# Altium project StEth32.PrjPcb
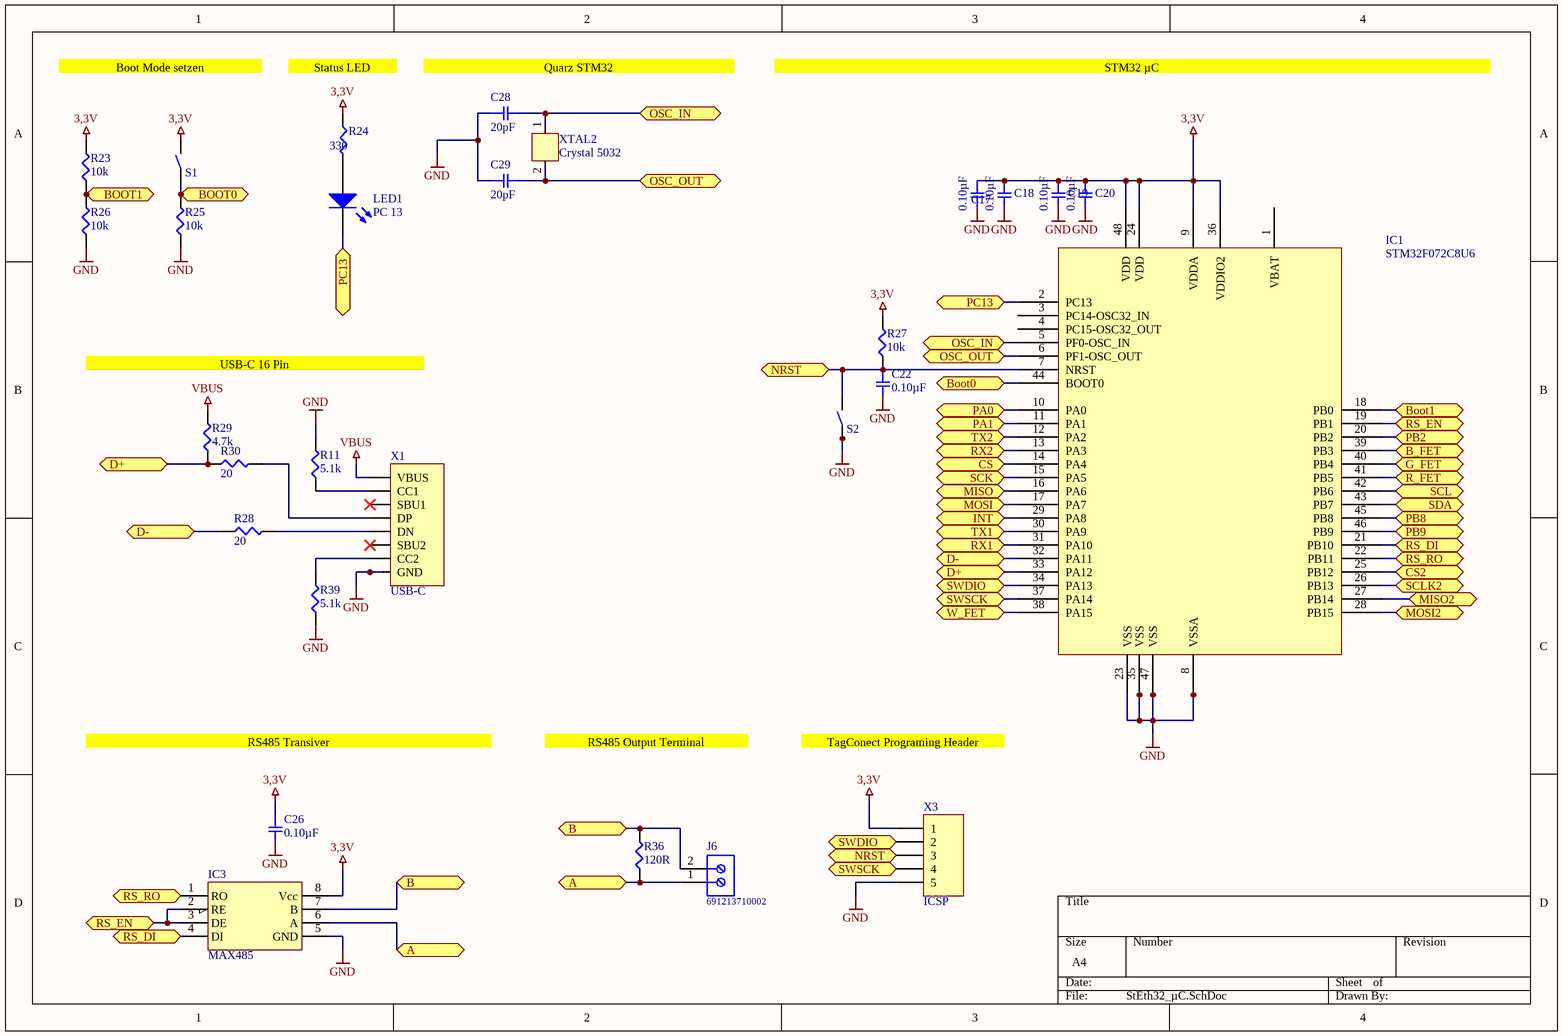
[diagram p0: StEth32_µC.SchDoc]
3 sheets, 105 parts. Net scope: flat (ports and power ports of the same name join across sheets).
Board file: StEth32.PcbDoc
Sheets:
  StEth32_µC.SchDoc
  StEth32_Power.SchDoc
  StEth32_W5500.SchDoc

## Sheet StEth32_µC.SchDoc
size A4

### Parts
C17  0.10µF  [SMD-0603C]
C18  0.10µF  [SMD-0603C]
C19  0.10µF  [SMD-0603C]
C20  0.10µF  [SMD-0603C]
C22  0.10µF  [SMD-0603C]
C26  0.10µF  [SMD-0603C]
C28  20pF  [SMD-0603C]
C29  20pF  [SMD-0603C]
IC1  STM32F072C8U6  [LQFP-48]
IC3  MAX485  [D008_L]
J6  691213710002  [691213710002]
LED1  PC 13  [0603_A]
R11  5.1k  [SMD-0603-RES]
R23  10k  [SMD-0603-RES]
R24  330  [SMD-0603-RES]
R25  10k  [SMD-0603-RES]
R26  10k  [SMD-0603-RES]
R27  10k  [SMD-0603-RES]
R28  20  [SMD-0603-RES]
R29  4.7k  [SMD-0603-RES]
R30  20  [SMD-0603-RES]
R36  120R  [SMD-0603-RES]
R39  5.1k  [SMD-0603-RES]
S1  Boot  [Button5050]  (value not drawn)
S2  Reset  [Button5050]  (value not drawn)
X1  USB-C  [USB-C]
X3  ICSP  [TC2030-MCP-NL]
XTAL2  Crystal 5032  [5032]

### Ports
A (bidir), B (bidir), B_FET (bidir), Boot0 (bidir), BOOT0 (bidir), BOOT1 (bidir), Boot1 (bidir), CS2 (bidir), CS (bidir), D+ (bidir), D- (bidir), G_FET (bidir), INT (bidir), MISO2 (bidir), MISO (bidir), MOSI2 (bidir), MOSI (bidir), NRST (bidir), OSC_IN (bidir), OSC_OUT (bidir), PA0 (bidir), PA1 (bidir), PB2 (bidir), PB8 (bidir), PB9 (bidir), PC13 (bidir), R_FET (bidir), RS_DI (bidir), RS_EN (bidir), RS_RO (bidir), RX1 (bidir), RX2 (bidir), SCK (bidir), SCL (bidir), SCLK2 (bidir), SDA (bidir), SWDIO (bidir), SWSCK (bidir), TX1 (bidir), TX2 (bidir), W_FET (bidir)

### Nets
3,3V: C17.1 C18.1 C19.1 C20.1 C26.1 IC1.9(VDDA) IC1.24(VDD) IC1.36(VDDIO2) IC1.48(VDD) IC3.8(Vcc) R23.2 R24.1 R27.2 S1.2 X3.1
GND: C17.2 C18.2 C19.2 C20.2 C22.2 C26.2 C28.1 C29.1 IC1.8(VSSA) IC1.23(VSS) IC1.35(VSS) IC1.47(VSS) IC3.5(GND) R11.2 R25.1 R26.1 R39.1 S2.1 X1.GND X3.5
VBUS: R29.2 X1.VBUS
NetC22_1: C22.1 IC1.7(NRST) R27.1 S2.2 X3.3 ; port NRST
NetC28_2: C28.2 IC1.5(PF0-OSC_IN) XTAL2.1 ; port OSC_IN
NetC29_2: C29.2 IC1.6(PF1-OSC_OUT) XTAL2.2 ; port OSC_OUT
NetIC1_2: IC1.2(PC13) LED1.1(K) ; port PC13
NetIC1_10: IC1.10(PA0) ; port PA0
NetIC1_11: IC1.11(PA1) ; port PA1
NetIC1_12: IC1.12(PA2) ; port TX2
NetIC1_13: IC1.13(PA3) ; port RX2
NetIC1_14: IC1.14(PA4) ; port CS
NetIC1_15: IC1.15(PA5) ; port SCK
NetIC1_16: IC1.16(PA6) ; port MISO
NetIC1_17: IC1.17(PA7) ; port MOSI
NetIC1_18: IC1.18(PB0) R23.1 R26.2 ; port BOOT1, port Boot1
NetIC1_19: IC1.19(PB1) IC3.2(RE) IC3.3(DE) ; port RS_EN
NetIC1_20: IC1.20(PB2) ; port PB2
NetIC1_21: IC1.21(PB10) IC3.4(DI) ; port RS_DI
NetIC1_22: IC1.22(PB11) IC3.1(RO) ; port RS_RO
NetIC1_25: IC1.25(PB12) ; port CS2
NetIC1_26: IC1.26(PB13) ; port SCLK2
NetIC1_27: IC1.27(PB14) ; port MISO2
NetIC1_28: IC1.28(PB15) ; port MOSI2
NetIC1_29: IC1.29(PA8) ; port INT
NetIC1_30: IC1.30(PA9) ; port TX1
NetIC1_31: IC1.31(PA10) ; port RX1
NetIC1_32: IC1.32(PA11) R28.1 ; port D-
NetIC1_33: IC1.33(PA12) R29.1 R30.1 ; port D+
NetIC1_34: IC1.34(PA13) X3.2 ; port SWDIO
NetIC1_37: IC1.37(PA14) X3.4 ; port SWSCK
NetIC1_38: IC1.38(PA15) ; port W_FET
NetIC1_39: IC1.39(PB3) ; port B_FET
NetIC1_40: IC1.40(PB4) ; port G_FET
NetIC1_41: IC1.41(PB5) ; port R_FET
NetIC1_42: IC1.42(PB6) ; port SCL
NetIC1_43: IC1.43(PB7) ; port SDA
NetIC1_44: IC1.44(BOOT0) R25.2 S1.1 ; port Boot0, port BOOT0
NetIC1_45: IC1.45(PB8) ; port PB8
NetIC1_46: IC1.46(PB9) ; port PB9
NetIC3_6: IC3.6(A) J6.1 R36.1 ; port A
NetIC3_7: IC3.7(B) J6.2 R36.2 ; port B
NetLED1_2: LED1.2(A) R24.2
NetR11_1: R11.1 X1.CC1
NetR28_2: R28.2 X1.DN
NetR30_2: R30.2 X1.DP
NetR39_2: R39.2 X1.CC2

Not connected (* = marked no-connect by the designer): IC1 1(VBAT) 3(PC14-OSC32_IN) 4(PC15-OSC32_OUT); X1 SBU1*

### Notes on the sheet
- Boot Mode setzen
- Status LED
- Quarz STM32
- STM32 µC
  STM32 µC
- USB-C 16 Pin
- RS485 Transiver
- RS485 Output Terminal
- TagConect Programing Header

### Library data of the parts
C17-C20 C22 C26 C28 C29 = GCM188R71C104KA37J: CAP CER 0.1UF 16V X7R 0603; Manufacturer: Murata Electronics North America; Factory Stock: 0; Unit Price (USD): 0.18; Minimum Quantity: 1; Tolerance: ±10%; Datasheets: http://www.murata.com/~/media/webrenewal/support/library/catalog/products/capacitor/mlcc/c03e.ashx; Image: //media.digikey.com/Renders/Murata%20Renders/0603%28GCM188%29.jpg; Digi-Key Part Number: 490-8015-1-ND; Part Number: GCM188R71C104KA37J; Quantity Available: 17844; @ qty: 0; Packaging: Cut Tape (CT); Series: GCM; Part Status: Active; Voltage: 16V; Temperature Coefficient: X7R; Operating Temperature: -55°C ~ 125°C; Features: -; Ratings: AEC-Q200; Applications: Automotive; Mounting Type: Surface Mount, MLCC; Package / Case: 0603 (1608 Metric); Size / Dimension: 0.063" L x 0.031" W (1.60mm x 0.80mm); Height - Seated (Max): -; Thickness (Max): 0.035" (0.90mm); Lead Spacing: -; Lead Style: -
  C17-C20 C22 C26: Value: 0.10µF
  C28 C29: Value: 20pF
J6 = 691213710002: Serie 213 - 5.00 mm Horizontal Entry Modular with RisingCage Clamp WR-TBL, 2 pin; Pin Number: 2; Pitch: 5.00 mm; ComponentLink1Description: Manufacturer; ComponentLink1URL: http://www.we-online.de; ComponentLink2Description: Datasheet; ComponentLink2URL: http://katalog.we-online.de/em/datasheet/6912137100xx.pdf; Part Number: 691213710002; Published Date: June 2018; Publisher: Wurth Elektronik; Operating Temperature: -40 to 105 degC; Mounting Technology: THT; Packaging: Box
LED1 = 150060SS75000: SMD mono-color Chip LED, WL-SMCW, Super Red; PackageReference: 0603_A; Color: Super Red; PartNumber: 150060SS75000; ComponentLink1Description: Manufacturer URL; ComponentLink1URL: http://www.we-online.com; ComponentLink2Description: Datasheet; ComponentLink2URL: http://katalog.we-online.com/led/datasheet/150060SS75000.pdf
R11 R39 = ERJ-3GEYJ512V: RES SMD 5.1K OHM 5% 1/10W 0603; Manufacturer: Panasonic Electronic Components; Factory Stock: 0; Unit Price (USD): 0.00321; @ qty: 1500; Minimum Quantity: 1; Power (Watts): 0.1W, 1/10W; Temperature Coefficient: ±200ppm/°C; Part Number: ERJ-3GEYJ512V; Datasheets: http://industrial.panasonic.com/www-cgi/jvcr13pz.cgi?E+PZ+3+AOA0001+ERJ3GEYJ512V+7+WW; Image: //media.digikey.com/Photos/Panasonic%20Photos/MFG_ERJ-P6W%20Series.jpg; Digi-Key Part Number: P5.1KGCT-ND; Quantity Available: 285626; Packaging: Cut Tape (CT); Series: ERJ; Part Status: Active; Value: 5.1k; Tolerance: ±5%; Composition: Thick Film; Features: Automotive AEC-Q200; Operating Temperature: -55°C ~ 155°C; Package / Case: 0603 (1608 Metric); Supplier Device Package: 0603; Size / Dimension: 0.063" L x 0.031" W (1.60mm x 0.80mm); Height - Seated (Max): 0.022" (0.55mm); Number of Terminations: 2; Failure Rate: -
R23 R25-R27 = ERJ-3EKF1002V: RES SMD 10K OHM 1% 1/10W 0603; Manufacturer: Panasonic Electronic Components; Factory Stock: 0; Unit Price (USD): 0.00379; @ qty: 1500; Minimum Quantity: 1; Power (Watts): 0.1W, 1/10W; Temperature Coefficient: ±100ppm/°C; Part Number: ERJ-3EKF1002V; Datasheets: http://industrial.panasonic.com/www-cgi/jvcr13pz.cgi?E+PZ+3+AOA0002+ERJ3EKF1002V+7+WW; Image: //media.digikey.com/Photos/Panasonic%20Photos/MFG_ERJ-P6W%20Series.jpg; Digi-Key Part Number: P10.0KHCT-ND; Quantity Available: 6703141; Packaging: Cut Tape (CT); Series: ERJ; Part Status: Active; Value: 10k; Tolerance: ±1%; Composition: Thick Film; Features: Automotive AEC-Q200; Operating Temperature: -55°C ~ 155°C; Package / Case: 0603 (1608 Metric); Supplier Device Package: 0603; Size / Dimension: 0.063" L x 0.031" W (1.60mm x 0.80mm); Height - Seated (Max): 0.022" (0.55mm); Number of Terminations: 2; Failure Rate: -
R24 = ERJ-3EKF3300V: RES SMD 330 OHM 1% 1/10W 0603; Manufacturer: Panasonic Electronic Components; Factory Stock: 0; Unit Price (USD): 0.00379; @ qty: 1500; Minimum Quantity: 1; Power (Watts): 0.1W, 1/10W; Temperature Coefficient: ±100ppm/°C; Part Number: ERJ-3EKF3300V; Datasheets: http://industrial.panasonic.com/www-cgi/jvcr13pz.cgi?E+PZ+3+AOA0002+ERJ3EKF3300V+7+WW; Image: //media.digikey.com/Photos/Panasonic%20Photos/MFG_ERJ-P6W%20Series.jpg; Digi-Key Part Number: P330HCT-ND; Quantity Available: 670984; Packaging: Cut Tape (CT); Series: ERJ; Part Status: Active; Value: 330; Tolerance: ±1%; Composition: Thick Film; Features: Automotive AEC-Q200; Operating Temperature: -55°C ~ 155°C; Package / Case: 0603 (1608 Metric); Supplier Device Package: 0603; Size / Dimension: 0.063" L x 0.031" W (1.60mm x 0.80mm); Height - Seated (Max): 0.022" (0.55mm); Number of Terminations: 2; Failure Rate: -
R28 R30 = ERJ-3EKF20R0V: RES SMD 20 OHM 1% 1/10W 0603; Manufacturer: Panasonic Electronic Components; Factory Stock: 0; Unit Price (USD): 0.00379; @ qty: 1500; Minimum Quantity: 1; Power (Watts): 0.1W, 1/10W; Temperature Coefficient: ±100ppm/°C; Part Number: ERJ-3EKF20R0V; Datasheets: http://industrial.panasonic.com/www-cgi/jvcr13pz.cgi?E+PZ+3+AOA0002+ERJ3EKF20R0V+7+WW; Image: //media.digikey.com/Photos/Panasonic%20Photos/MFG_ERJ-P6W%20Series.jpg; Digi-Key Part Number: P20.0HCT-ND; Quantity Available: 92419; Packaging: Cut Tape (CT); Series: ERJ; Part Status: Active; Value: 20; Tolerance: ±1%; Composition: Thick Film; Features: Automotive AEC-Q200; Operating Temperature: -55°C ~ 155°C; Package / Case: 0603 (1608 Metric); Supplier Device Package: 0603; Size / Dimension: 0.063" L x 0.031" W (1.60mm x 0.80mm); Height - Seated (Max): 0.022" (0.55mm); Number of Terminations: 2; Failure Rate: -
R29 R36 = ERJ-3EKF4701V: RES SMD 4.7K OHM 1% 1/10W 0603; Manufacturer: Panasonic Electronic Components; Factory Stock: 0; Unit Price (USD): 0.00379; @ qty: 1500; Minimum Quantity: 1; Power (Watts): 0.1W, 1/10W; Temperature Coefficient: ±100ppm/°C; Part Number: ERJ-3EKF4701V; Datasheets: http://industrial.panasonic.com/www-cgi/jvcr13pz.cgi?E+PZ+3+AOA0002+ERJ3EKF4701V+7+WW; Image: //media.digikey.com/Photos/Panasonic%20Photos/MFG_ERJ-P6W%20Series.jpg; Digi-Key Part Number: P4.70KHCT-ND; Quantity Available: 999380; Packaging: Cut Tape (CT); Series: ERJ; Part Status: Active; Tolerance: ±1%; Composition: Thick Film; Features: Automotive AEC-Q200; Operating Temperature: -55°C ~ 155°C; Package / Case: 0603 (1608 Metric); Supplier Device Package: 0603; Size / Dimension: 0.063" L x 0.031" W (1.60mm x 0.80mm); Height - Seated (Max): 0.022" (0.55mm); Number of Terminations: 2; Failure Rate: -
  R29: Value: 4.7k
  R36: Value: 120R
S1 S2 = Button: 6.1x3.7x2.5mm
X1 = USB-C 16P
XTAL2 = 5032

## Sheet StEth32_Power.SchDoc
size A4
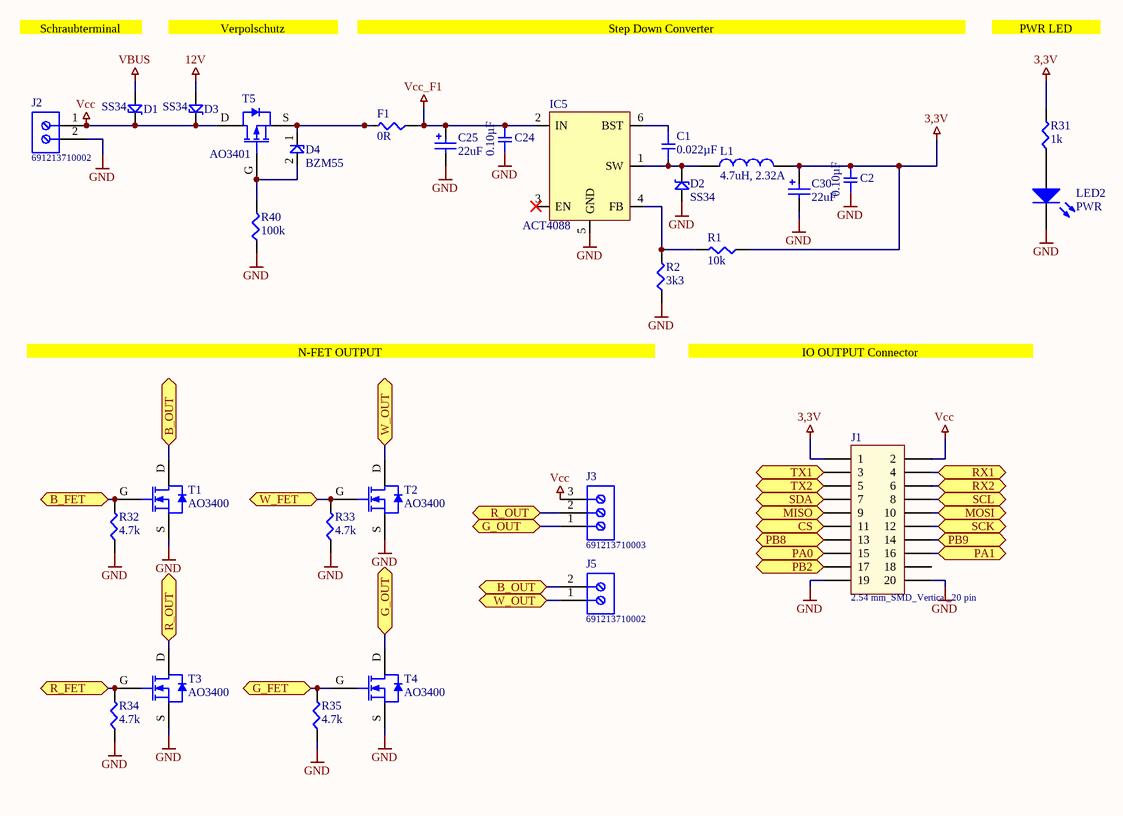
[diagram p1: StEth32_Power.SchDoc]

### Parts
C1  0.022µF  [SMD-0603C]
C2  0.10µF  [SMD-0603C]
C24  0.10µF  [SMD-0603C]
C25  value 22uF  [WCAP-ASLI_4x5.5]  (hidden comment: 865080140001)
C30  value 22uF  [WCAP-ASLI_4x5.5]  (hidden comment: 865080140001)
D1  SS34  [B240A]
D2  SS34  [B240A]
D3  SS34  [B240A]
D4  BZM55  [SMD-0603-RES]
F1  0R  [SMD-0603-RES]
IC5  ACT4088  [SOT23-6]
J1  2.54 mm_SMD_Vertical_20 pin  [61002021121]
J2  691213710002  [691213710002]
J3  691213710003  [691213710003]
J5  691213710002  [691213710002]
L1  4.7uH, 2.32A  [WE-PD_7332]
LED2  PWR  [0603_A]
R1  10k  [SMD-0603-RES]
R2  3k3  [SMD-0603-RES]
R31  1k  [SMD-0603-RES]
R32  4.7k  [SMD-0603-RES]
R33  4.7k  [SMD-0603-RES]
R34  4.7k  [SMD-0603-RES]
R35  4.7k  [SMD-0603-RES]
R40  100k  [SMD-0603-RES]
T1  AO3400  [SOT23]
T2  AO3400  [SOT23]
T3  AO3400  [SOT23]
T4  AO3400  [SOT23]
T5  AO3401  [SOT23]

### Ports
B_FET (bidir), B_OUT (bidir), CS (bidir), G_FET (bidir), G_OUT (bidir), MISO (bidir), MOSI (bidir), PA0 (bidir), PA1 (bidir), PB2 (bidir), PB8 (bidir), PB9 (bidir), R_FET (bidir), R_OUT (bidir), RX1 (bidir), RX2 (bidir), SCK (bidir), SCL (bidir), SDA (bidir), TX1 (bidir), TX2 (bidir), W_FET (bidir), W_OUT (bidir)

### Nets
3,3V: C2.1 C30.1(P) J1.1 L1.2 R1.1 R31.2
12V: D3.A
GND: C2.2 C24.2 C25.2(N) C30.2(N) D2.A IC5.5(GND) J1.19 J1.20 J2.2 LED2.1(K) R2.1 R32.1 R33.1 R34.1 R35.1 R40.1 T1.S T2.S T3.S T4.S
VBUS: D1.A
Vcc: D1.K D3.K J1.2 J2.1 J3.3 T5.D
Vcc_F1: C24.1 C25.1(P) F1.1 IC5.2(IN)
NetC1_1: C1.1 IC5.6(BST)
NetC1_2: C1.2 D2.K IC5.1(SW) L1.1
NetD4_1: D4.1 F1.2 T5.S
NetD4_2: D4.2 R40.2 T5.G
NetIC1_10: J1.15 ; port PA0
NetIC1_11: J1.16 ; port PA1
NetIC1_12: J1.5 ; port TX2
NetIC1_13: J1.6 ; port RX2
NetIC1_14: J1.11 ; port CS
NetIC1_15: J1.12 ; port SCK
NetIC1_16: J1.9 ; port MISO
NetIC1_17: J1.10 ; port MOSI
NetIC1_20: J1.17 ; port PB2
NetIC1_30: J1.3 ; port TX1
NetIC1_31: J1.4 ; port RX1
NetIC1_38: R33.2 T2.G ; port W_FET
NetIC1_39: R32.2 T1.G ; port B_FET
NetIC1_40: R35.2 T4.G ; port G_FET
NetIC1_41: R34.2 T3.G ; port R_FET
NetIC1_42: J1.8 ; port SCL
NetIC1_43: J1.7 ; port SDA
NetIC1_45: J1.13 ; port PB8
NetIC1_46: J1.14 ; port PB9
NetIC5_4: IC5.4(FB) R1.2 R2.2
NetJ3_1: J3.1 T4.D ; port G_OUT
NetJ3_2: J3.2 T3.D ; port R_OUT
NetJ5_1: J5.1 T2.D ; port W_OUT
NetJ5_2: J5.2 T1.D ; port B_OUT
NetLED2_2: LED2.2(A) R31.1

Not connected (* = marked no-connect by the designer): IC5 3(EN)*; J1 18

### Notes on the sheet
- Schraubterminal
- Verpolschutz
- Step Down Converter
- PWR LED
- N-FET OUTPUT
- IO OUTPUT Connector

### Library data of the parts
C1 = GCJ188R71H223KA01D: CAP CER 0.022UF 50V X7R 0603; Manufacturer: Murata Electronics North America; Factory Stock: 0; Unit Price (USD): 0.22; Minimum Quantity: 1; Tolerance: ±10%; Datasheets: http://www.murata.com/~/media/webrenewal/support/library/catalog/products/capacitor/mlcc/c03e.ashx; Image: //media.digikey.com/Renders/Murata%20Renders/0603%28LQG18%29.jpg; Digi-Key Part Number: 490-5851-1-ND; Part Number: GCJ188R71H223KA01D; Quantity Available: 7651; @ qty: 0; Packaging: Cut Tape (CT); Series: GCJ; Part Status: Active; Value: 0.022µF; Voltage: 50V; Temperature Coefficient: X7R; Operating Temperature: -55°C ~ 125°C; Features: Soft Termination; Ratings: AEC-Q200; Applications: Automotive, Boardflex Sensitive; Mounting Type: Surface Mount, MLCC; Package / Case: 0603 (1608 Metric); Size / Dimension: 0.063" L x 0.031" W (1.60mm x 0.80mm); Height - Seated (Max): -; Thickness (Max): 0.031" (0.80mm); Lead Spacing: -; Lead Style: -
C2 C24 = GCM188R71C104KA37J: as C17 on sheet StEth32_µC; Datasheets: http://www.murata.com/~/media/webrenewal/support/library/catalog/products/capacitor/mlcc/c03e.ashx; Image: //media.digikey.com/Renders/Murata%20Renders/0603%28GCM188%29.jpg; Digi-Key Part Number: 490-8015-1-ND; Part Number: GCM188R71C104KA37J; Quantity Available: 17844; @ qty: 0; Packaging: Cut Tape (CT); Series: GCM; Part Status: Active; Value: 0.10µF; Voltage: 16V; Temperature Coefficient: X7R; Operating Temperature: -55°C ~ 125°C; Features: -; Ratings: AEC-Q200; Applications: Automotive; Mounting Type: Surface Mount, MLCC; Package / Case: 0603 (1608 Metric); Size / Dimension: 0.063" L x 0.031" W (1.60mm x 0.80mm); Height - Seated (Max): -; Thickness (Max): 0.035" (0.90mm); Lead Spacing: -; Lead Style: -
C25 C30 = 865080140001: WCAP-ASLI Aluminum Electrolytic Capacitors, size Ф4x5.5mm, 6.3V DC, 22uF; Rated Voltage: 6.3V DC; ComponentLink1Description: Manufacturer; ComponentLink1URL: http://www.we-online.de; ComponentLink2Description: Datasheet; ComponentLink2URL: http://katalog.we-online.de/pbs/datasheet/865080140001.pdf; Part Number: 865080140001; Published Date: June 2017; Publisher: Wurth Elektronik; Size: Ф4x5.5mm; Life Cycle: 2000h; Operating Temperature: -55 °C up to +105 °C
D1-D3 = B240A: Shottkydiode
F1 R1 R2 R31 = ERJ-3EKF1001V: RES SMD 1K OHM 1% 1/10W 0603; Manufacturer: Panasonic Electronic Components; Factory Stock: 0; Unit Price (USD): 0.00379; @ qty: 1500; Minimum Quantity: 1; Power (Watts): 0.1W, 1/10W; Temperature Coefficient: ±100ppm/°C; Part Number: ERJ-3EKF1001V; Datasheets: http://industrial.panasonic.com/www-cgi/jvcr13pz.cgi?E+PZ+3+AOA0002+ERJ3EKF1001V+7+WW; Image: //media.digikey.com/Photos/Panasonic%20Photos/MFG_ERJ-P6W%20Series.jpg; Digi-Key Part Number: P1.00KHCT-ND; Quantity Available: 5218845; Packaging: Cut Tape (CT); Series: ERJ; Part Status: Active; Tolerance: ±1%; Composition: Thick Film; Features: Automotive AEC-Q200; Operating Temperature: -55°C ~ 155°C; Package / Case: 0603 (1608 Metric); Supplier Device Package: 0603; Size / Dimension: 0.063" L x 0.031" W (1.60mm x 0.80mm); Height - Seated (Max): 0.022" (0.55mm); Number of Terminations: 2; Failure Rate: -
  F1: Value: 0R
  R1: Value: 10k
  R2: Value: 3k3
  R31: Value: 1k
J1 = 61002021121: Pin Header WR-PHD, pitch 2.54 mm, SMD, Vertical, dual row, 20 pin; Rated Current: 3 A; Pin Number: 20; Pitch: 2.54 mm; Working Voltage: 250 VAC; Contact Resistance: 20 mOhm; Insulation Resistance: >1000 MOhm; ComponentLink1Description: Manufacturer; ComponentLink1URL: http://www.we-online.de; ComponentLink2Description: Datasheet; ComponentLink2URL: http://katalog.we-online.de/em/datasheet/6100xx21121.pdf; Part Number: 61002021121; Published Date: Jan. 2018; Publisher: Wurth Elektronik; Operating Temperature: -40 to 105 degC; Mounting Technology: SMD; Row Number: Dual; Orientation: Vertical
J2 J5 = 691213710002: as J6 on sheet StEth32_µC; ComponentLink1Description: Manufacturer; ComponentLink1URL: http://www.we-online.de; ComponentLink2Description: Datasheet; ComponentLink2URL: http://katalog.we-online.de/em/datasheet/6912137100xx.pdf; Part Number: 691213710002; Published Date: June 2018; Publisher: Wurth Elektronik; Operating Temperature: -40 to 105 degC; Mounting Technology: THT; Packaging: Box
J3 = 691213710003: Serie 213 - 5.00 mm Horizontal Entry Modular with RisingCage Clamp WR-TBL, 3 pin; Pin Number: 3; Pitch: 5.00 mm; ComponentLink1Description: Manufacturer; ComponentLink1URL: http://www.we-online.de; ComponentLink2Description: Datasheet; ComponentLink2URL: http://katalog.we-online.de/em/datasheet/6912137100xx.pdf; Part Number: 691213710003; Published Date: June 2018; Publisher: Wurth Elektronik; Operating Temperature: -40 to 105 degC; Mounting Technology: THT; Packaging: Box
L1 = 744778004: WE-PD SMT Power Inductor, size 7332, 4.7uH, 2.32A; DC Resistance max.: 60mOhm; Self Resonant Frequency: 45MHz; Saturation Current: 4.2A; ComponentLink1Description: Manufacturer; ComponentLink1URL: http://www.we-online.de; ComponentLink2Description: Datasheet; ComponentLink2URL: https://katalog.we-online.com/pbs/datasheet/744778004.pdf; Part Number: 744778004; Published Date: April 2019; Publisher: Wurth Elektronik; Rated Current: 2.32A; Size: 7332; Inductance: 4.7uH; Operating Temperature: -40 to +125degC; Mounting Technology: SMT; Packaging: Tape and Reel
LED2 = 150060SS75000: as LED1 on sheet StEth32_µC; PackageReference: 0603_A; Color: Super Red; PartNumber: 150060SS75000; ComponentLink1Description: Manufacturer URL; ComponentLink1URL: http://www.we-online.com; ComponentLink2Description: Datasheet; ComponentLink2URL: http://katalog.we-online.com/led/datasheet/150060SS75000.pdf
R32-R35 R40 = ERJ-3EKF4701V: as R29 on sheet StEth32_µC; Part Number: ERJ-3EKF4701V; Datasheets: http://industrial.panasonic.com/www-cgi/jvcr13pz.cgi?E+PZ+3+AOA0002+ERJ3EKF4701V+7+WW; Image: //media.digikey.com/Photos/Panasonic%20Photos/MFG_ERJ-P6W%20Series.jpg; Digi-Key Part Number: P4.70KHCT-ND; Quantity Available: 999380; Packaging: Cut Tape (CT); Series: ERJ; Part Status: Active; Tolerance: ±1%; Composition: Thick Film; Features: Automotive AEC-Q200; Operating Temperature: -55°C ~ 155°C; Package / Case: 0603 (1608 Metric); Supplier Device Package: 0603; Size / Dimension: 0.063" L x 0.031" W (1.60mm x 0.80mm); Height - Seated (Max): 0.022" (0.55mm); Number of Terminations: 2; Failure Rate: -
  R32-R35: Value: 4.7k
  R40: Value: 100k
T1-T4 = AO3400: AO3400 MOSFET 30V
T5 = AO3401: AO3401 MOSFET 30V

## Sheet StEth32_W5500.SchDoc
size A4
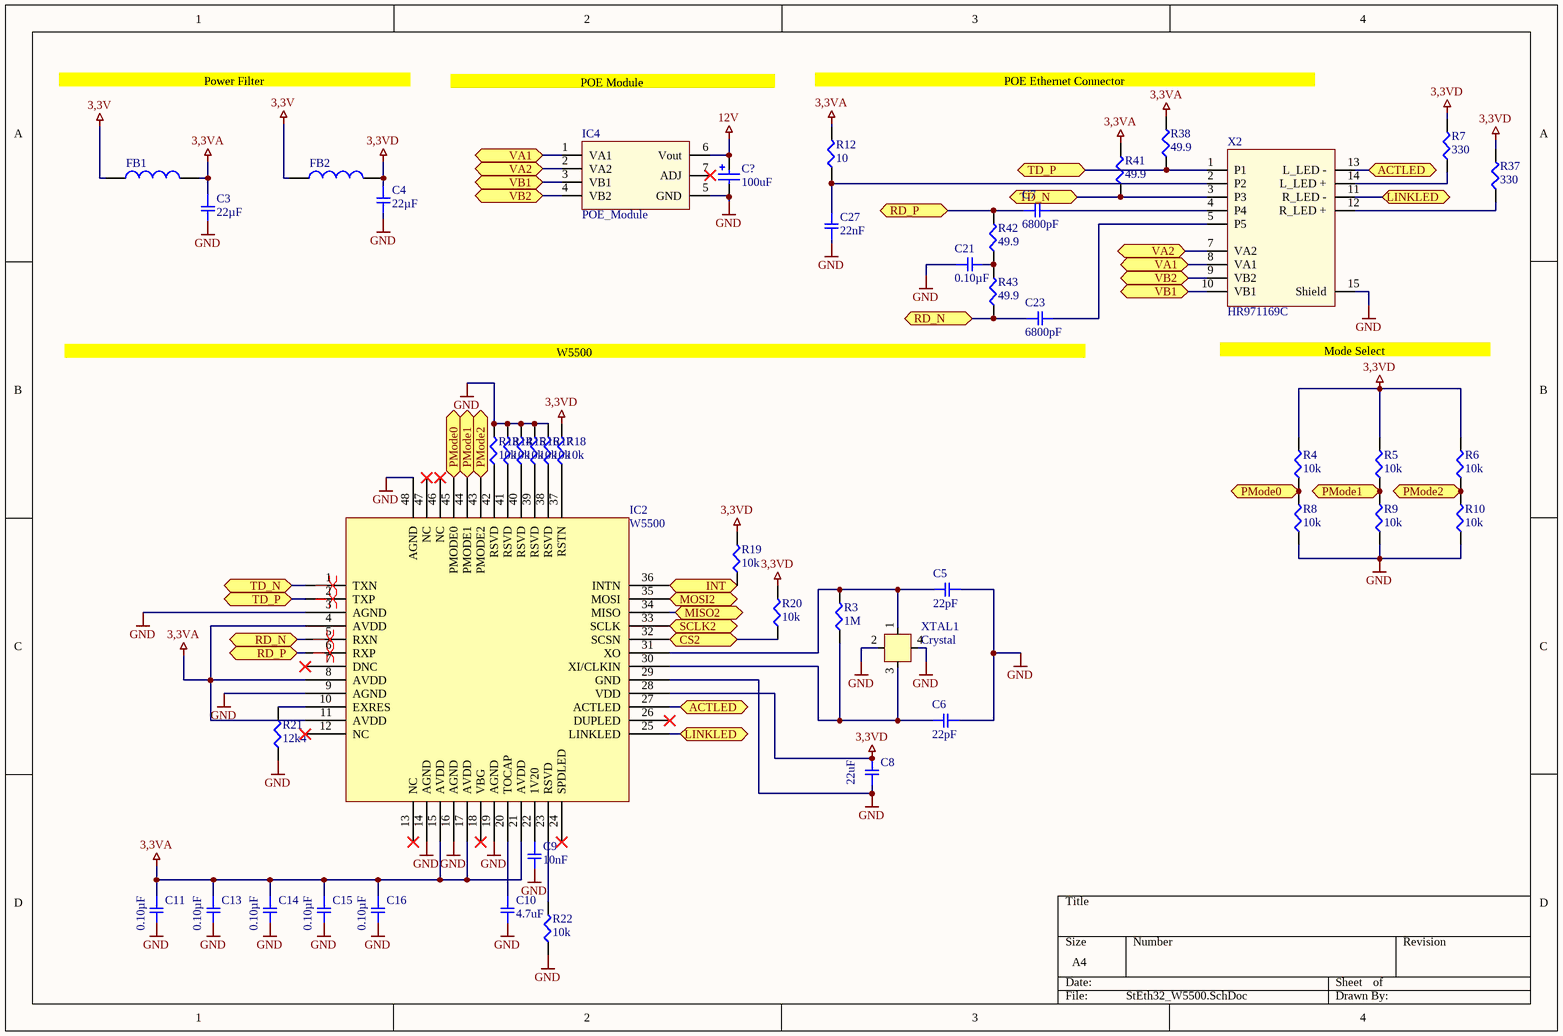
[diagram p2: StEth32_W5500.SchDoc]

### Parts
C3  22µF  [SMD-0603C]
C4  22µF  [SMD-0603C]
C5  22pF  [SMD-0603C]
C6  22pF  [SMD-0603C]
C7  6800pF  [SMD-0603C]
C8  22uF  [SMD-0603C]
C9  10nF  [SMD-0603C]
C10  4.7uF  [SMD-0603C]
C11  0.10µF  [SMD-0603C]
C13  0.10µF  [SMD-0603C]
C14  0.10µF  [SMD-0603C]
C15  0.10µF  [SMD-0603C]
C16  0.10µF  [SMD-0603C]
C21  0.10µF  [SMD-0603C]
C23  6800pF  [SMD-0603C]
C27  22nF  [SMD-0603C]
C?  value 100uF  [WCAP-ASLI_6.3x7.7]  (hidden comment: 865080445010)
FB1  600Ohm, 0.2A  [WE-CBF_0805_High Speed]  (value not drawn)
FB2  600Ohm, 0.2A  [WE-CBF_0805_High Speed]  (value not drawn)
IC2  W5500  [LQFP-48]
IC4  POE_Module  [POE_Module]
R3  1M  [SMD-0402-RES]
R4  10k  [SMD-0603-RES]
R5  10k  [SMD-0603-RES]
R6  10k  [SMD-0603-RES]
R7  330  [SMD-0603-RES]
R8  10k  [SMD-0603-RES]
R9  10k  [SMD-0603-RES]
R10  10k  [SMD-0603-RES]
R12  10  [SMD-0603-RES]
R13  10k  [SMD-0603-RES]
R14  10k  [SMD-0603-RES]
R15  10k  [SMD-0603-RES]
R16  10k  [SMD-0603-RES]
R17  10k  [SMD-0603-RES]
R18  10k  [SMD-0603-RES]
R19  10k  [SMD-0603-RES]
R20  10k  [SMD-0603-RES]
R21  12k4  [SMD-0603-RES]
R22  10k  [SMD-0603-RES]
R37  330  [SMD-0603-RES]
R38  49.9  [SMD-0603-RES]
R41  49.9  [SMD-0603-RES]
R42  49.9  [SMD-0603-RES]
R43  49.9  [SMD-0603-RES]
X2  HR971169C  [HR971169C]
XTAL1  Crystal  [3225]

### Ports
ACTLED (bidir), CS2 (bidir), INT (bidir), LINKLED (bidir), MISO2 (bidir), MOSI2 (bidir), PMode0 (bidir), PMode1 (bidir), PMode2 (bidir), RD_N (bidir), RD_P (bidir), SCLK2 (bidir), TD_N (bidir), TD_P (bidir), VA1 (bidir), VA2 (bidir), VB1 (bidir), VB2 (bidir)

### Nets
3,3V: FB1.1 FB2.1
3,3VA: C3.1 C11.1 C13.1 C14.1 C15.1 C16.1 FB1.2 IC2.4(AVDD) IC2.8(AVDD) IC2.11(AVDD) IC2.15(AVDD) IC2.17(AVDD) IC2.21(AVDD) R12.2 R38.2 R41.2
3,3VD: C4.1 C8.1 FB2.2 IC2.28(VDD) R4.2 R5.2 R6.2 R7.2 R18.2 R19.2 R20.2 R37.2
12V: C?.1(P) IC4.6(Vout)
GND: C3.2 C4.2 C5.1 C6.1 C8.2 C9.2 C10.2 C11.2 C13.2 C14.2 C15.2 C16.2 C21.1 C27.1 C?.2(N) IC2.3(AGND) IC2.9(AGND) IC2.14(AGND) IC2.16(AGND) IC2.19(AGND) IC2.29(GND) IC2.48(AGND) IC4.5(GND) R8.1 R9.1 R10.1 R13.2 R14.2 R15.2 R16.2 R17.2 R21.1 R22.1 X2.15(Shield) XTAL1.2 XTAL1.4
NetC5_2: C5.2 IC2.31(XO) R3.2 XTAL1.1
NetC6_2: C6.2 IC2.30(XI/CLKIN) R3.1 XTAL1.3
NetC7_1: C7.1 IC2.6(RXP) R42.2 ; port RD_P
NetC7_2: C7.2 X2.4(P4)
NetC9_1: C9.1 IC2.22(1V20)
NetC10_1: C10.1 IC2.20(TOCAP)
NetC21_2: C21.2 R42.1 R43.2
NetC23_1: C23.1 IC2.5(RXN) R43.1 ; port RD_N
NetC23_2: C23.2 X2.5(P5)
NetC27_2: C27.2 R12.1 X2.2(P2)
NetIC1_25: IC2.32(SCSN) R20.1 ; port CS2
NetIC1_26: IC2.33(SCLK) ; port SCLK2
NetIC1_27: IC2.34(MISO) ; port MISO2
NetIC1_28: IC2.35(MOSI) ; port MOSI2
NetIC1_29: IC2.36(INTN) R19.1 ; port INT
NetIC2_1: IC2.1(TXN) R41.1 X2.3(P3) ; port TD_N
NetIC2_2: IC2.2(TXP) R38.1 X2.1(P1) ; port TD_P
NetIC2_10: IC2.10(EXRES) R21.2
NetIC2_23: IC2.23(RSVD) R22.2
NetIC2_25: IC2.25(LINKLED) X2.11(R_LED_-) ; port LINKLED
NetIC2_27: IC2.27(ACTLED) X2.13(L_LED_-) ; port ACTLED
NetIC2_37: IC2.37(RSTN) R18.1
NetIC2_38: IC2.38(RSVD) R17.1
NetIC2_39: IC2.39(RSVD) R16.1
NetIC2_40: IC2.40(RSVD) R15.1
NetIC2_41: IC2.41(RSVD) R14.1
NetIC2_42: IC2.42(RSVD) R13.1
NetIC2_43: IC2.43(PMODE2) R6.1 R10.2 ; port PMode2
NetIC2_44: IC2.44(PMODE1) R5.1 R9.2 ; port PMode1
NetIC2_45: IC2.45(PMODE0) R4.1 R8.2 ; port PMode0
NetIC4_1: IC4.1(VA1) X2.8(VA1) ; port VA1
NetIC4_2: IC4.2(VA2) X2.7(VA2) ; port VA2
NetIC4_3: IC4.3(VB1) X2.10(VB1) ; port VB1
NetIC4_4: IC4.4(VB2) X2.9(VB2) ; port VB2
NetR7_1: R7.1 X2.14(L_LED_+)
NetR37_1: R37.1 X2.12(R_LED_+)

Not connected (* = marked no-connect by the designer): IC2 7(DNC)* 12(NC)* 13(NC)* 18(VBG)* 24(SPDLED)* 26(DUPLED)* 46(NC)* 47(NC)*; IC4 7(ADJ)*

### Layout directives
differential pair: (no net found under the mark)

### Notes on the sheet
- Power Filter
- POE Module
- POE Ethernet Connector
- W5500
- (near X2) Mode Select

### Library data of the parts
C3 C4 = ZRB186R60G226ME11L: CAP CER 22UF 4V X5R 0603; Manufacturer: Murata Electronics North America; Factory Stock: 0; Unit Price (USD): 0.36; Minimum Quantity: 1; Tolerance: ±20%; Datasheets: http://psearch.en.murata.com/capacitor/product/ZRB186R60G226ME11%23.pdf; Image: //media.digikey.com/Renders/Murata%20Renders/0603%20(1608%20Metric).jpg; Digi-Key Part Number: 490-13253-1-ND; Part Number: ZRB186R60G226ME11L; Quantity Available: 3925; @ qty: 0; Packaging: Cut Tape (CT); Series: ZRB; Part Status: Active; Value: 22µF; Voltage: 4V; Temperature Coefficient: X5R; Operating Temperature: -55°C ~ 85°C; Features: Interposer Termination; Ratings: -; Applications: Acoustic Noise Reduction; Mounting Type: Surface Mount, MLCC; Package / Case: 0603 (1608 Metric); Size / Dimension: 0.063" L x 0.031" W (1.60mm x 0.80mm); Height - Seated (Max): -; Thickness (Max): 0.031" (0.80mm); Lead Spacing: -; Lead Style: -
C5 C6 C27 = GCM188R72A223KA37D: CAP CER 0.022UF 100V X7R 0603; Manufacturer: Murata Electronics North America; Factory Stock: 0; Unit Price (USD): 0.11; Minimum Quantity: 1; Tolerance: ±10%; Datasheets: http://www.murata.com/~/media/webrenewal/support/library/catalog/products/capacitor/mlcc/c03e.ashx; Image: //media.digikey.com/Renders/Murata%20Renders/0603%28GCM188%29.jpg; Digi-Key Part Number: 490-4782-1-ND; Part Number: GCM188R72A223KA37D; Quantity Available: 102005; @ qty: 0; Packaging: Cut Tape (CT); Series: GCM; Part Status: Active; Voltage: 100V; Temperature Coefficient: X7R; Operating Temperature: -55°C ~ 125°C; Features: -; Ratings: AEC-Q200; Applications: Automotive; Mounting Type: Surface Mount, MLCC; Package / Case: 0603 (1608 Metric); Size / Dimension: 0.063" L x 0.031" W (1.60mm x 0.80mm); Height - Seated (Max): -; Thickness (Max): 0.035" (0.90mm); Lead Spacing: -; Lead Style: -
  C5 C6: Value: 22pF
  C27: Value: 22nF
C7 C23 = GCM188R71H682KA37D: CAP CER 6800PF 50V X7R 0603; Manufacturer: Murata Electronics North America; Factory Stock: 0; Unit Price (USD): 0.1; Minimum Quantity: 1; Tolerance: ±10%; Datasheets: http://www.murata.com/~/media/webrenewal/support/library/catalog/products/capacitor/mlcc/c03e.ashx; Image: //media.digikey.com/Renders/Murata%20Renders/0603%28GCM188%29.jpg; Digi-Key Part Number: 490-6055-1-ND; Part Number: GCM188R71H682KA37D; Quantity Available: 31753; @ qty: 0; Packaging: Cut Tape (CT); Series: GCM; Part Status: Active; Value: 6800pF; Voltage: 50V; Temperature Coefficient: X7R; Operating Temperature: -55°C ~ 125°C; Features: -; Ratings: AEC-Q200; Applications: Automotive; Mounting Type: Surface Mount, MLCC; Package / Case: 0603 (1608 Metric); Size / Dimension: 0.063" L x 0.031" W (1.60mm x 0.80mm); Height - Seated (Max): -; Thickness (Max): 0.035" (0.90mm); Lead Spacing: -; Lead Style: -
C8 = GCM188R71C104KA37J: CAP CER 0.1UF 16V X7R 0603; Manufacturer: Murata Electronics North America; Factory Stock: 0; Unit Price (USD): 0.18; Minimum Quantity: 1; Tolerance: ±10%; Voltage: 6.3V; Datasheets: http://www.murata.com/~/media/webrenewal/support/library/catalog/products/capacitor/mlcc/c03e.ashx; Image: //media.digikey.com/Renders/Murata%20Renders/0603%28GCM188%29.jpg; Digi-Key Part Number: 490-8015-1-ND; Part Number: GCM188R71C104KA37J; Quantity Available: 17844; @ qty: 0; Packaging: Cut Tape (CT); Series: GCM; Part Status: Active; Value: 22uF; Temperature Coefficient: X7R; Operating Temperature: -55°C ~ 125°C; Features: -; Ratings: AEC-Q200; Applications: Automotive; Mounting Type: Surface Mount, MLCC; Package / Case: 0603 (1608 Metric); Size / Dimension: 0.063" L x 0.031" W (1.60mm x 0.80mm); Height - Seated (Max): -; Thickness (Max): 0.035" (0.90mm); Lead Spacing: -; Lead Style: -
C9 C21 = GCJ188R71C104KA01D: CAP CER 0.1UF 16V X7R 0603; Manufacturer: Murata Electronics North America; Factory Stock: 0; Unit Price (USD): 0.21; Minimum Quantity: 1; Tolerance: ±10%; Datasheets: http://www.murata.com/~/media/webrenewal/support/library/catalog/products/capacitor/mlcc/c03e.ashx; Image: //media.digikey.com/Renders/Murata%20Renders/0603%28LQG18%29.jpg; Digi-Key Part Number: 490-5796-1-ND; Part Number: GCJ188R71C104KA01D; Quantity Available: 22473; @ qty: 0; Packaging: Cut Tape (CT); Series: GCJ; Part Status: Active; Voltage: 16V; Temperature Coefficient: X7R; Operating Temperature: -55°C ~ 125°C; Features: Soft Termination; Ratings: AEC-Q200; Applications: Automotive, Boardflex Sensitive; Mounting Type: Surface Mount, MLCC; Package / Case: 0603 (1608 Metric); Size / Dimension: 0.063" L x 0.031" W (1.60mm x 0.80mm); Height - Seated (Max): -; Thickness (Max): 0.035" (0.90mm); Lead Spacing: -; Lead Style: -
  C9: Value: 10nF
  C21: Value: 0.10µF
C10 = GCJ188R71C104KA01D: CAP CER 0.1UF 16V X7R 0603; Manufacturer: Murata Electronics North America; Factory Stock: 0; Unit Price (USD): 0.21; Minimum Quantity: 1; Tolerance: ±10%; Voltage: 6.3V; Datasheets: http://www.murata.com/~/media/webrenewal/support/library/catalog/products/capacitor/mlcc/c03e.ashx; Image: //media.digikey.com/Renders/Murata%20Renders/0603%28LQG18%29.jpg; Digi-Key Part Number: 490-5796-1-ND; Part Number: GCJ188R71C104KA01D; Quantity Available: 22473; @ qty: 0; Packaging: Cut Tape (CT); Series: GCJ; Part Status: Active; Value: 4.7uF; Temperature Coefficient: X7R; Operating Temperature: -55°C ~ 125°C; Features: Soft Termination; Ratings: AEC-Q200; Applications: Automotive, Boardflex Sensitive; Mounting Type: Surface Mount, MLCC; Package / Case: 0603 (1608 Metric); Size / Dimension: 0.063" L x 0.031" W (1.60mm x 0.80mm); Height - Seated (Max): -; Thickness (Max): 0.035" (0.90mm); Lead Spacing: -; Lead Style: -
C11 C13-C16 = GCM188R71C104KA37J: as C17 on sheet StEth32_µC; Datasheets: http://www.murata.com/~/media/webrenewal/support/library/catalog/products/capacitor/mlcc/c03e.ashx; Image: //media.digikey.com/Renders/Murata%20Renders/0603%28GCM188%29.jpg; Digi-Key Part Number: 490-8015-1-ND; Part Number: GCM188R71C104KA37J; Quantity Available: 17844; @ qty: 0; Packaging: Cut Tape (CT); Series: GCM; Part Status: Active; Value: 0.10µF; Voltage: 16V; Temperature Coefficient: X7R; Operating Temperature: -55°C ~ 125°C; Features: -; Ratings: AEC-Q200; Applications: Automotive; Mounting Type: Surface Mount, MLCC; Package / Case: 0603 (1608 Metric); Size / Dimension: 0.063" L x 0.031" W (1.60mm x 0.80mm); Height - Seated (Max): -; Thickness (Max): 0.035" (0.90mm); Lead Spacing: -; Lead Style: -
C? = 865080445010: WCAP-ASLI Aluminum Electrolytic Capacitors, size Ф6.3x7.7mm, 25V DC, 100uF; Rated Voltage: 25V DC; ComponentLink1Description: Manufacturer; ComponentLink1URL: http://www.we-online.de; ComponentLink2Description: Datasheet; ComponentLink2URL: http://katalog.we-online.de/pbs/datasheet/865080445010.pdf; Part Number: 865080445010; Published Date: June 2017; Publisher: Wurth Elektronik; Size: Ф6.3x7.7mm; Life Cycle: 2000h; Operating Temperature: -55 °C up to +105 °C
FB1 FB2 = 742792042: WE-CBF SMT EMI Suppression Ferrite Bead, size 0805, 600Ohm, 0.2A; Impedance max.: 3000Ohm; DC Resistance max.: 0.5Ohm; Type: High Speed; ComponentLink1Description: Manufacturer; ComponentLink1URL: http://www.we-online.de; ComponentLink2Description: Datasheet; ComponentLink2URL: https://katalog.we-online.com/pbs/datasheet/742792042.pdf; Part Number: 742792042; Published Date: March 2019; Publisher: Wurth Elektronik; Rated Current: 0.2A; Operating Temperature: -55 to +125degC; Impedance@100 MHz: 600Ohm; Mounting Technology: SMT; Packaging: Tape and Reel; Size: 0805
R3 = ERJ-2GEJ105X: RES SMD 1M OHM 5% 1/10W 0402; Manufacturer: Panasonic Electronic Components; Factory Stock: 0; Unit Price (USD): 0.00350; @ qty: 1500; Minimum Quantity: 1; Power (Watts): 0.1W, 1/10W; Temperature Coefficient: ±200ppm/°C; Part Number: ERJ-2GEJ105X; Datasheets: http://industrial.panasonic.com/www-cgi/jvcr13pz.cgi?E+PZ+3+AOA0001+ERJ2GEJ105X+7+WW; Image: //media.digikey.com/Photos/Panasonic%20Photos/ERJ-PA2-Series.jpg; Digi-Key Part Number: P1.0MJCT-ND; Quantity Available: 1082572; Packaging: Cut Tape (CT); Series: ERJ; Part Status: Active; Value: 1M; Tolerance: ±5%; Composition: Thick Film; Features: Automotive AEC-Q200; Operating Temperature: -55°C ~ 155°C; Package / Case: 0402 (1005 Metric); Supplier Device Package: 0402; Size / Dimension: 0.039" L x 0.020" W (1.00mm x 0.50mm); Height - Seated (Max): 0.016" (0.40mm); Number of Terminations: 2; Failure Rate: -
R4-R6 R8-R10 R13-R20 R22 = ERJ-3EKF1002V: as R23 on sheet StEth32_µC; Part Number: ERJ-3EKF1002V; Datasheets: http://industrial.panasonic.com/www-cgi/jvcr13pz.cgi?E+PZ+3+AOA0002+ERJ3EKF1002V+7+WW; Image: //media.digikey.com/Photos/Panasonic%20Photos/MFG_ERJ-P6W%20Series.jpg; Digi-Key Part Number: P10.0KHCT-ND; Quantity Available: 6703141; Packaging: Cut Tape (CT); Series: ERJ; Part Status: Active; Value: 10k; Tolerance: ±1%; Composition: Thick Film; Features: Automotive AEC-Q200; Operating Temperature: -55°C ~ 155°C; Package / Case: 0603 (1608 Metric); Supplier Device Package: 0603; Size / Dimension: 0.063" L x 0.031" W (1.60mm x 0.80mm); Height - Seated (Max): 0.022" (0.55mm); Number of Terminations: 2; Failure Rate: -
R7 R12 R37 = ERJ-3EKF3300V: as R24 on sheet StEth32_µC; Part Number: ERJ-3EKF3300V; Datasheets: http://industrial.panasonic.com/www-cgi/jvcr13pz.cgi?E+PZ+3+AOA0002+ERJ3EKF3300V+7+WW; Image: //media.digikey.com/Photos/Panasonic%20Photos/MFG_ERJ-P6W%20Series.jpg; Digi-Key Part Number: P330HCT-ND; Quantity Available: 670984; Packaging: Cut Tape (CT); Series: ERJ; Part Status: Active; Tolerance: ±1%; Composition: Thick Film; Features: Automotive AEC-Q200; Operating Temperature: -55°C ~ 155°C; Package / Case: 0603 (1608 Metric); Supplier Device Package: 0603; Size / Dimension: 0.063" L x 0.031" W (1.60mm x 0.80mm); Height - Seated (Max): 0.022" (0.55mm); Number of Terminations: 2; Failure Rate: -
  R7 R37: Value: 330
  R12: Value: 10
R21 = ERJ-3BQF1R1V: RES SMD 12,4 KOHM 1% 1/4W 0603; Manufacturer: Panasonic Electronic Components; Factory Stock: 0; Unit Price (USD): 0.05386; @ qty: 1500; Minimum Quantity: 1; Power (Watts): 0.25W, 1/4W; Temperature Coefficient: ±200ppm/°C; Part Number: ERJ-3BQF1R1V; Datasheets: https://industrial.panasonic.com/cdbs/www-data/pdf/RDA0000/AOA0000C239.pdf; Image: //media.digikey.com/Photos/Panasonic%20Photos/MFG_ERJ-P6W%20Series.jpg; Digi-Key Part Number: P17372CT-ND; Quantity Available: 3896; Packaging: Cut Tape (CT); Series: ERJ; Part Status: Active; Value: 12k4; Tolerance: ±1%; Composition: Thick Film; Features: Automotive AEC-Q200, Current Sense; Operating Temperature: -55°C ~ 125°C; Package / Case: 0603 (1608 Metric); Supplier Device Package: 0603; Size / Dimension: 0.063" L x 0.031" W (1.60mm x 0.80mm); Height - Seated (Max): 0.022" (0.55mm); Number of Terminations: 2; Failure Rate: -
R38 R41-R43 = ERJ-3EKF49R9V: RES SMD 49.9 OHM 1% 1/10W 0603; Manufacturer: Panasonic Electronic Components; Factory Stock: 0; Unit Price (USD): 0.00379; @ qty: 1500; Minimum Quantity: 1; Power (Watts): 0.1W, 1/10W; Temperature Coefficient: ±100ppm/°C; Part Number: ERJ-3EKF49R9V; Datasheets: http://industrial.panasonic.com/www-cgi/jvcr13pz.cgi?E+PZ+3+AOA0002+ERJ3EKF49R9V+7+WW; Image: //media.digikey.com/Photos/Panasonic%20Photos/MFG_ERJ-P6W%20Series.jpg; Digi-Key Part Number: P49.9HCT-ND; Quantity Available: 566023; Packaging: Cut Tape (CT); Series: ERJ; Part Status: Active; Value: 49.9; Tolerance: ±1%; Composition: Thick Film; Features: Automotive AEC-Q200; Operating Temperature: -55°C ~ 155°C; Package / Case: 0603 (1608 Metric); Supplier Device Package: 0603; Size / Dimension: 0.063" L x 0.031" W (1.60mm x 0.80mm); Height - Seated (Max): 0.022" (0.55mm); Number of Terminations: 2; Failure Rate: -
XTAL1 = 3225

## Nets that join several sheets
3,3V: StEth32_µC (15 pins), StEth32_Power (6 pins), StEth32_W5500 (FB1.1 FB2.1)
12V: StEth32_Power (D3.A), StEth32_W5500 (C?.1 IC4.6)
GND: StEth32_µC (20 pins), StEth32_Power (20 pins), StEth32_W5500 (36 pins)
VBUS: StEth32_µC (R29.2 X1.VBUS), StEth32_Power (D1.A)
NetIC1_10: StEth32_µC (IC1.10), StEth32_Power (J1.15)
NetIC1_11: StEth32_µC (IC1.11), StEth32_Power (J1.16)
NetIC1_12: StEth32_µC (IC1.12), StEth32_Power (J1.5)
NetIC1_13: StEth32_µC (IC1.13), StEth32_Power (J1.6)
NetIC1_14: StEth32_µC (IC1.14), StEth32_Power (J1.11)
NetIC1_15: StEth32_µC (IC1.15), StEth32_Power (J1.12)
NetIC1_16: StEth32_µC (IC1.16), StEth32_Power (J1.9)
NetIC1_17: StEth32_µC (IC1.17), StEth32_Power (J1.10)
NetIC1_20: StEth32_µC (IC1.20), StEth32_Power (J1.17)
NetIC1_25: StEth32_µC (IC1.25), StEth32_W5500 (IC2.32 R20.1)
NetIC1_26: StEth32_µC (IC1.26), StEth32_W5500 (IC2.33)
NetIC1_27: StEth32_µC (IC1.27), StEth32_W5500 (IC2.34)
NetIC1_28: StEth32_µC (IC1.28), StEth32_W5500 (IC2.35)
NetIC1_29: StEth32_µC (IC1.29), StEth32_W5500 (IC2.36 R19.1)
NetIC1_30: StEth32_µC (IC1.30), StEth32_Power (J1.3)
NetIC1_31: StEth32_µC (IC1.31), StEth32_Power (J1.4)
NetIC1_38: StEth32_µC (IC1.38), StEth32_Power (R33.2 T2.G)
NetIC1_39: StEth32_µC (IC1.39), StEth32_Power (R32.2 T1.G)
NetIC1_40: StEth32_µC (IC1.40), StEth32_Power (R35.2 T4.G)
NetIC1_41: StEth32_µC (IC1.41), StEth32_Power (R34.2 T3.G)
NetIC1_42: StEth32_µC (IC1.42), StEth32_Power (J1.8)
NetIC1_43: StEth32_µC (IC1.43), StEth32_Power (J1.7)
NetIC1_45: StEth32_µC (IC1.45), StEth32_Power (J1.13)
NetIC1_46: StEth32_µC (IC1.46), StEth32_Power (J1.14)